# EAGLE design dualstep (EAGLE 5.11)
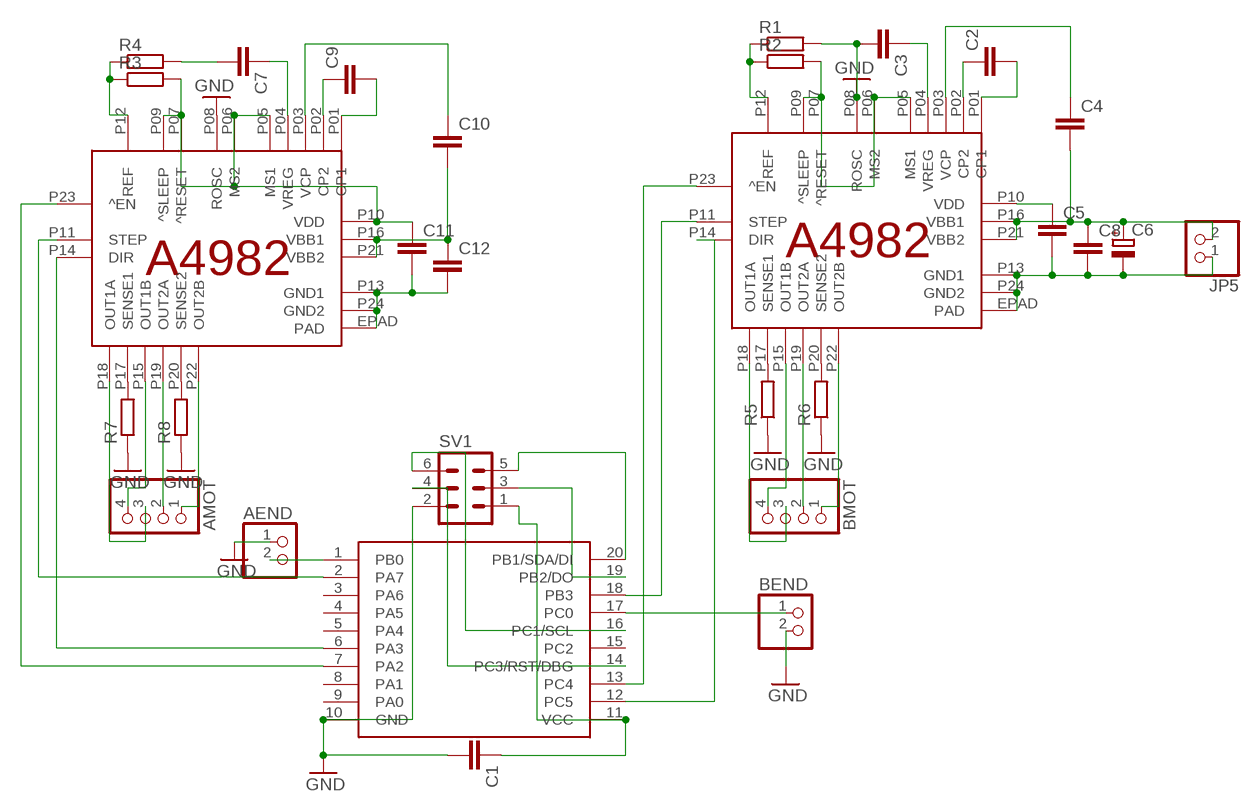
[diagram p0: schematic, sheet 1]

## Parts
AEND  PINHD-1X2  [1X02]
AMOT  PINHD-1X4  [1X04]
BEND  PINHD-1X2  [1X02]
BMOT  PINHD-1X4  [1X04]
C1  C-EUC0603K  [C0603K]
C2  C-EUC0603K  [C0603K]
C3  C-EUC0603K  [C0603K]
C4  C-EUC0603K  [C0603K]
C5  C-EUC0603K  [C0603K]
C6  CPOL-EU153CLV-0605  [153CLV-0605]
C7  C-EUC0603K  [C0603K]
C8  C-EUC0603K  [C0603K]
C9  C-EUC0603K  [C0603K]
C10  C-EUC0603K  [C0603K]
C11  C-EUC0603K  [C0603K]
C12  C-EUC0603K  [C0603K]
JP5  PINHD-1X2  [1X02]
R1  R-EU_R0603  [R0603]
R2  R-EU_R0603  [R0603]
R3  R-EU_R0603  [R0603]
R4  R-EU_R0603  [R0603]
R5  R-EU_R0603  [R0603]
R6  R-EU_R0603  [R0603]
R7  R-EU_R0603  [R0603]
R8  R-EU_R0603  [R0603]
SV1  MA03-2  [MA03-2]
U$1  ATTINY1634  [SOIC20]
U$2  A4982  [ETSSOP24]
U$3  A4982  [ETSSOP24]

## Nets
GND: AEND.1 BEND.2 C1.2 C3.2 C5.2 C6.- C7.2 C8.2 C11.2 C12.2 JP5.1 R1.2 R4.2 R5.1 R6.1 R7.1 R8.1 SV1.2 U$1.10(GND) U$2.EPAD(PAD) U$2.P08(ROSC) U$2.P13(GND1) U$2.P24(GND2) U$3.EPAD(PAD) U$3.P08(ROSC) U$3.P13(GND1) U$3.P24(GND2)
N$1: U$1.12(PC5) U$3.P14(DIR)
N$2: U$1.18(PB3) U$3.P11(STEP)
N$3: R1.1 R2.1 U$3.P12(REF)
N$4: C2.1 U$3.P02(CP2)
N$5: C3.1 U$3.P04(VREG)
N$6: C2.2 U$3.P01(CP1)
N$7: C4.1 U$3.P03(VCP)
N$8: R3.1 R4.1 U$2.P12(REF)
N$9: U$1.13(PC4) U$3.P23(^EN)
N$10: SV1.5 U$1.20(PB1/SDA/DI)
N$11: SV1.3 U$1.19(PB2/DO)
N$12: SV1.6 U$1.16(PC1/SCL)
N$13: SV1.4 U$1.14(PC3/RST/DBG)
N$15: C7.1 U$2.P04(VREG)
N$16: C9.1 U$2.P02(CP2)
N$17: C9.2 U$2.P01(CP1)
N$18: C10.1 U$2.P03(VCP)
N$19: AEND.2 U$1.1(PB0)
N$20: R5.2 U$3.P17(SENSE1)
N$21: R6.2 U$3.P20(SENSE2)
N$22: R7.2 U$2.P17(SENSE1)
N$23: R8.2 U$2.P20(SENSE2)
N$24: AMOT.4 U$2.P15(OUT1B)
N$25: AMOT.1 U$2.P22(OUT2B)
N$26: AMOT.2 U$2.P19(OUT2A)
N$27: AMOT.3 U$2.P18(OUT1A)
N$28: BMOT.4 U$3.P15(OUT1B)
N$29: BMOT.1 U$3.P22(OUT2B)
N$30: BMOT.2 U$3.P19(OUT2A)
N$31: BMOT.3 U$3.P18(OUT1A)
N$32: BEND.1 U$1.17(PC0)
N$33: U$1.2(PA7) U$2.P11(STEP)
N$34: U$1.6(PA3) U$2.P14(DIR)
N$35: U$1.7(PA2) U$2.P23(^EN)
VDD: C1.1 C5.1 C11.1 R2.2 R3.2 SV1.1 U$1.11(VCC) U$2.P05(MS1) U$2.P06(MS2) U$2.P07(^RESET) U$2.P09(^SLEEP) U$2.P10(VDD) U$3.P05(MS1) U$3.P06(MS2) U$3.P07(^RESET) U$3.P09(^SLEEP) U$3.P10(VDD)
VMOT: C4.2 C6.+ C8.1 C10.2 C12.1 JP5.2 U$2.P16(VBB1) U$2.P21(VBB2) U$3.P16(VBB1) U$3.P21(VBB2)
Unconnected: U$1.3(PA6) U$1.4(PA5) U$1.5(PA4) U$1.8(PA1) U$1.9(PA0) U$1.15(PC2)

## Library data of the parts
AEND BEND JP5 = pinhead:PINHD-1X2: PIN HEADER
AMOT BMOT = pinhead:PINHD-1X4: PIN HEADER
C1-C5 C7-C12 = rcl:C-EU: CAPACITOR, European symbol
C6 = rcl:CPOL-EU: POLARIZED CAPACITOR, European symbol
R1-R8 = rcl:R-EU_: RESISTOR, European symbol
SV1 = con-lstb:MA03-2: PIN HEADER; OC_FARNELL: unknown; OC_NEWARK: unknown
U$1 = untitled:ATTINY1634
U$2 U$3 = untitled:A4982

## Board
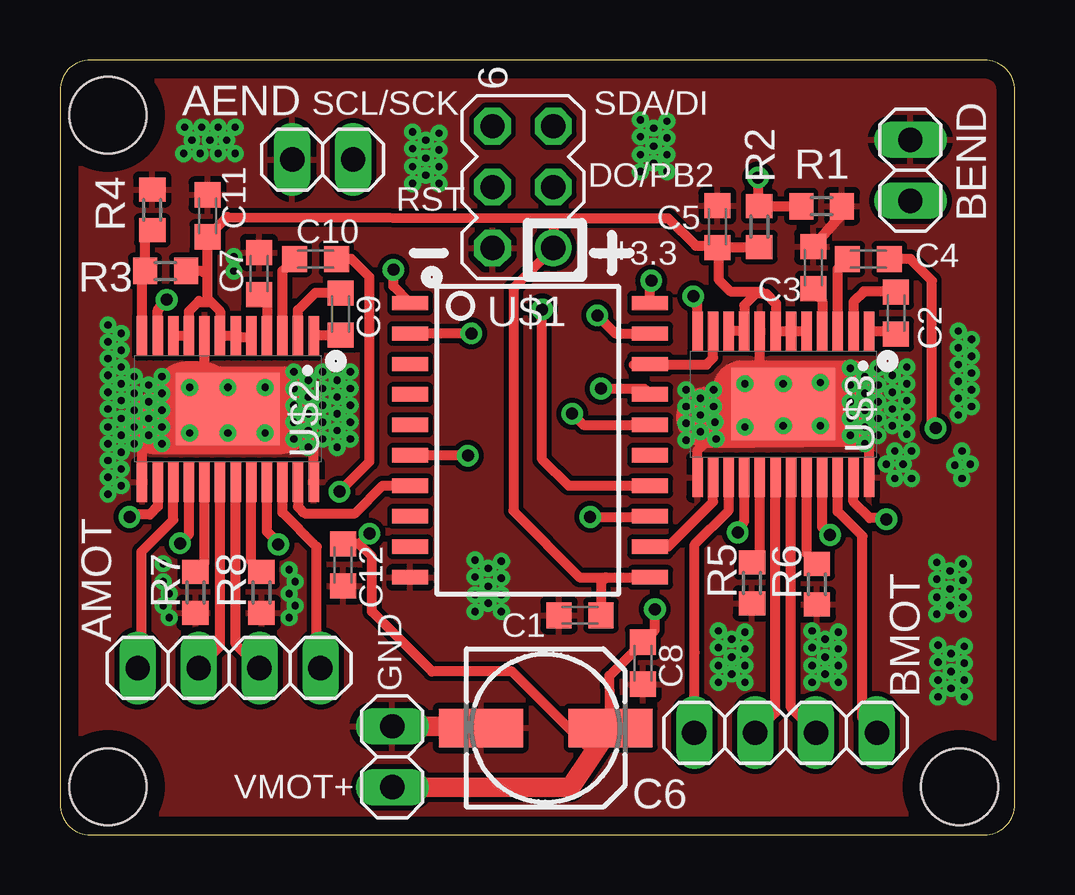
[diagram p1: board, top side]
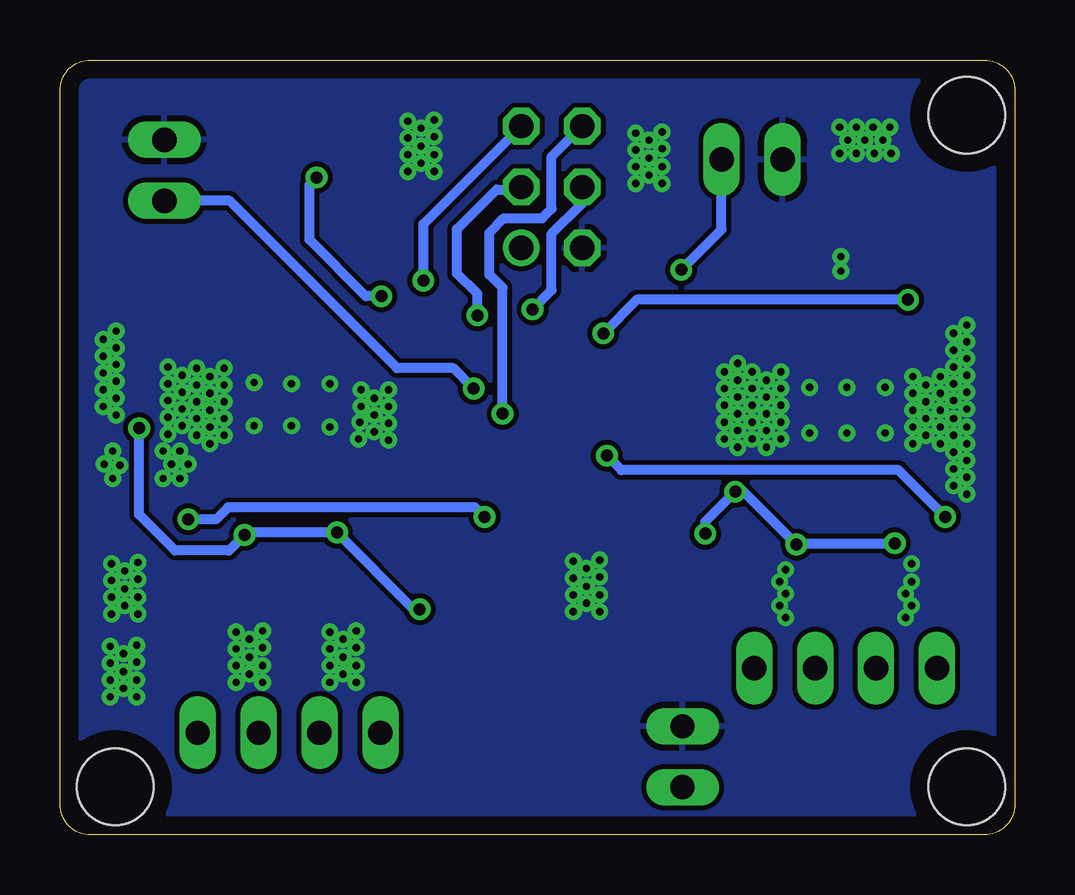
[diagram p2: board, bottom side, seen from below]

Size 39.8 x 32.3 mm. Coordinates in mm from the lower left corner, seen from the top.
Outline: 39.8,31.03 arc90 38.53,32.3 1.27,32.3 arc90 0,31.03 0,1.27 arc90 1.27,0 38.53,0 arc90 39.8,1.27 39.8,31.03
Copper layers (1*16): Top 0.035mm / dielectric 1.5mm / Bottom 0.035mm
Design rules "default *": minimum track width 10mil, minimum drill 10mil, track to track 8mil, track to pad 8mil, pad to pad 8mil, via to via 8mil, smd to smd 0mil, copper to edge 30mil, drill to drill 8mil, minimum pad ring 10mil, minimum via ring 8mil, stop-mask expansion 1mil, vias tented up to drill 20mil, thermal gap 10mil
Holes 3.2 mm at 2,2 2,30 37.5,2

### Footprints (pad centres in the part's own frame; a part is rotated, then mirrored left to right if it is on the bottom)
1X02 = drill 1.016 long: 1 -1.27,0; 2 1.27,0
1X04 = drill 1.016 long: 1 -3.81,0; 2 -1.27,0; 3 1.27,0; 4 3.81,0
C0603K = smd 1.05 x 1.08: 1 -0.875,0; 2 0.875,0
153CLV-0605 = smd 3.5 x 1.6: + 2.7,0; - -2.7,0
R0603 = smd 1 x 1.1: 1 -0.85,0; 2 0.85,0
MA03-2 = drill 1.016 round: 1 -2.54,-1.27 | drill 1.016 octagon: 2 -2.54,1.27; 3 0,-1.27; 4 0,1.27; 5 2.54,-1.27; 6 2.54,1.27
SOIC20 = smd 0.6 x 1.5: 1 -5.715,-5; 2 -4.445,-5; 3 -3.175,-5; 4 -1.905,-5; 5 -0.635,-5; 6 0.635,-5; 7 1.905,-5; 8 3.175,-5; 9 4.445,-5; 10 5.715,-5; 11 5.715,5; 12 4.445,5; 13 3.175,5; 14 1.905,5; 15 0.635,5; 16 -0.635,5; 17 -1.905,5; 18 -3.175,5; 19 -4.445,5; 20 -5.715,5
ETSSOP24 = smd 3 x 4.32: EPAD 0,0 | smd 1.635 x 0.44: P01 -3.05,3.575; P02 -3.05,2.925; P03 -3.05,2.275; P04 -3.05,1.625; P05 -3.05,0.975; P06 -3.05,0.325; P07 -3.05,-0.325; P08 -3.05,-0.975; P09 -3.05,-1.625; P10 -3.05,-2.275; P11 -3.05,-2.925; P12 -3.05,-3.575; P13 3.05,-3.575; P14 3.05,-2.925; P15 3.05,-2.275; P16 3.05,-1.625; P17 3.05,-0.975; P18 3.05,-0.325; P19 3.05,0.325; P20 3.05,0.975; P21 3.05,1.625; P22 3.05,2.275; P23 3.05,2.925; P24 3.05,3.575

### Placement (x,y rotation side)
AEND  10.95,28.15 0 top
AMOT  7.05,6.95 180 top
BEND  35.45,27.7 90 top
BMOT  30.25,4.25 180 top
C1  21.68,9.15 180 top
C2  34.85,21.75 270 top
C3  31.4,23.65 90 top
C4  33.7,24 0 top
C5  27.4,25.35 90 top
C6  20.25,4.45 0 top
C7  8.3,23.4 90 top
C8  24.3,7.15 270 top
C9  11.7,21.7 270 top
C10  10.65,24 0 top
C11  6.15,25.8 90 top
C12  11.8,11.25 270 top
JP5  13.85,3.25 270 top
R1  31.75,26.2 0 top
R2  29.15,25.35 270 top
R3  4.4,23.5 0 top
R4  3.85,26.05 90 top
R5  28.85,10.5 90 top
R6  31.55,10.45 90 top
R7  5.65,10.1 90 top
R8  8.4,10.1 90 top
SV1  19.3,27 90 top
U$1  19.6,16.45 270 top
U$2  7,17.75 270 top
U$3  30.15,17.95 270 top

### Tracks (layer width: path | path; a pad name or v marks a point on that pad's centre or on a via)
GND  (via drill 0.3)
  Top 0.406: U$3.P08 29.18,18.93 29.32,18.77 | 29.32,18.77 U$3.EPAD 30.2,18 32.1,18 33.73,16.38 U$3.P24 | R1.2 32.6,25.88 C3.2 | U$3.P13 26.57,16.02 29.32,18.77 | 6.03,18.73 U$2.P08 | 6.03,18.73 U$2.EPAD 7.1,17.85 9.75,17.85 10.53,17.07 U$2.P24 | U$2.P13 3.42,16.12 6.03,18.73
  Top 0.813: JP5.1 16.58,4.52 C6.-
  Top 2.54: 26.95,17.4 33,17.45 33,18.5 28.45,18.5 28.45,18.45 | 3.85,17.15 9.25,17.15 9.25,18.25 5.95,18.25 5.95,18.45 5.2,18.45 5.2,18.4
  other vias: 5.4,18.65 5.4,16.75 7,18.65 7,16.75 8.55,16.75 8.55,18.65 9.75,19.3 9.75,18.6 9.75,17.9 9.75,17.2 9.75,16.5 10.35,16.85 10.35,17.55 10.35,18.25 10.35,18.95 10.35,16.15 10.95,18.6 10.95,19.3 10.95,17.9 10.95,17.2 10.95,16.5 11.55,16.85 11.55,16.15 11.55,17.55 11.55,18.25 11.55,18.95 11.55,19.65 12.1,19.3 12.1,18.6 12.1,17.9 12.1,17.2 12.1,16.5 3.1,18.4 3.1,19.1 3.1,17.7 3.1,17 3.1,16.3 3.7,16.65 3.7,17.35 3.7,18.05 3.7,18.75 4.25,19.1 4.25,18.4 4.25,17.7 4.25,17 4.25,16.3 2,18.45 2,17.75 2,19.15 2,19.85 2,20.55 2,21.25 2.55,20.9 2.55,20.2 2.55,19.5 2.55,18.8 2.55,18.1 2,14.9 2,14.2 2,15.6 2,16.3 2,17 2.55,17.35 2.55,16.65 2.55,15.95 2.55,15.25 2.55,14.55 26.1,18.55 26.1,17.85 26.1,17.15 26.7,17.5 26.7,18.2 27.25,18.55 27.25,17.85 32.95,18.75 32.95,19.45 32.95,18.05 32.95,17.35 32.95,16.65 33.55,17 33.55,16.3 33.55,17.7 33.55,18.4 33.55,19.1 34.1,19.45 34.1,18.75 34.1,18.05 34.1,17.35 34.1,16.65 34.7,19.15 34.7,18.45 34.7,17.75 34.7,17.05 35.3,17.4 35.3,16.7 35.3,18.1 35.3,18.8 35.3,19.5 37.45,18.2 37.45,17.5 37.45,18.9 37.45,19.6 37.45,20.3 37.45,21 38,20.65 38,19.95 38,19.25 38,18.55 38,17.85 35.5,14.85 34.8,14.85 37.6,14.85 37.3,15.4 37.95,15.45 35.15,15.45 34.45,15.45 34.8,16 35.5,16 37.6,16 27.3,17.2 26.7,16.8 27.35,16.5 26.1,16.45 28.55,18.8 30.15,18.8 31.7,18.85 31.7,17.05 30.15,17.05 28.55,17 7.25,23.5 7.25,24.1 5.2,29.5 5.9,29.5 6.6,29.5 7.3,29.5 5.15,28.4 5.85,28.4 5.5,28.95 7.3,28.4 6.6,28.4 6.25,28.95 6.95,28.95 15.8,29.25 15.8,28.55 15.8,27.85 15.8,27.15 14.7,29.3 14.7,28.6 15.25,28.95 14.7,27.15 14.7,27.85 15.25,28.2 15.25,27.5 25.3,29.75 25.3,29.05 25.3,28.35 25.3,27.65 24.2,29.8 24.2,29.1 24.75,29.45 24.2,27.65 24.2,28.35 24.75,28.7 24.75,28 18.4,11.4 18.4,10.7 18.4,10 18.4,9.3 17.3,11.45 17.3,10.75 17.85,11.1 17.3,9.3 17.3,10 17.85,10.35 17.85,9.65 37.65,11.3 37.65,10.6 37.65,9.9 37.65,9.2 36.55,11.35 36.55,10.65 37.1,11 36.55,9.2 36.55,9.9 37.1,10.25 37.1,9.55 37.7,7.85 37.7,7.15 37.7,6.45 37.7,5.75 36.6,7.9 36.6,7.2 37.15,7.55 36.6,5.75 36.6,6.45 37.15,6.8 37.15,6.1 28.55,8.45 28.55,7.75 28.55,7.05 28.55,6.35 27.45,8.5 27.45,7.8 28,8.15 27.45,6.35 27.45,7.05 28,7.4 28,6.7 32.45,8.45 32.45,7.75 32.45,7.05 32.45,6.35 31.35,8.5 31.35,7.8 31.9,8.15 31.35,6.35 31.35,7.05 31.9,7.4 31.9,6.7 4.3,11.3 4.3,10.55 4.55,10.05 4.3,9.55 4.55,9.05 9.55,11.05 9.8,10.55 9.55,10.05 9.8,9.55 9.55,9.05
  pour Bottom: -0.9,33.65 40.25,33.65 40.25,-2.3 -1.8,-2.3 -1.8,33.75
  pour Top: 0.6,32 39.25,32 39.25,0.15 0.15,0.15 0.15,31.6
N$1
  Top 0.406: U$3.P14 27.23,13.88 25.35,12 U$1.12
N$2
  Top 0.406: U$3.P11 27.23,19.88 26.95,19.6 23.93,19.6 U$1.18
N$3  (via drill 0.5)
  Top 0.406: R1.1 R2.1 29.1,26.25 v29.1,27.4 | U$3.P12 26.57,22.27 v26.4,22.45
  Bottom 0.406: v26.4,22.45 27.05,22.45 29.4,24.8 29.4,27.1 v29.1,27.4
N$4
  Top 0.406: U$3.P02 33.08,22.23 33.5,22.65 34.83,22.65 C2.1
N$5
  Top 0.406: U$3.P04 31.77,22.25 C3.1
N$6
  Top 0.406: U$3.P01 34.73,21 C2.2
N$7
  Top 0.406: U$3.P03 32.42,23.6 C4.1
N$8
  Top 0.406: U$2.P12 3.42,23.27 R3.1 3.55,25.1 R4.1
N$9  (via drill 0.5)
  Top 0.406: U$3.P23 33.08,13.88 33.75,13.2 34.4,13.2 v34.45,13.15 | v22.1,13.25 24.57,13.25 U$1.13
  Bottom 0.406: v34.45,13.15 33.3,13.15 32.8,13.65 22.5,13.65 v22.1,13.25
N$10  (via drill 0.5)
  Top 0.406: U$1.20 24.6,23.05 v24.65,23.1
  Bottom 0.406: v24.65,23.1 24.65,25.46 SV1.5
N$11  (via drill 0.5)
  Top 0.406: U$1.19 23.16,20.89 v22.4,21.65
  Bottom 0.406: v22.4,21.65 22.4,22.55 23.25,23.4 23.25,25.25 21.6,26.9 20.67,26.9 SV1.3
N$12  (via drill 0.5)
  Top 0.406: v21.35,17.55 21.82,17.09 U$1.16
  Bottom 0.406: SV1.6 19.3,28.27 19.3,26.1 19.7,25.7 21.3,25.7 21.9,25.1 21.9,23.35 21.35,22.8 v21.35,17.55
N$13  (via drill 0.5)
  Top 0.406: U$1.14 21.2,14.55 20.1,15.65 v20.1,21.9
  Bottom 0.406: SV1.4 18.03,26.32 19.3,25.05 19.3,22.7 v20.1,21.9
N$15
  Top 0.406: U$2.P04 8.62,22.15 C7.1
N$16
  Top 0.406: U$2.P02 9.93,21.88 10.65,22.6 11.68,22.6 C9.1
N$17
  Top 0.406: U$2.P01 11.68,20.8 C9.2
N$18
  Top 0.406: U$2.P03 9.28,23.5 C10.1
N$19  (via drill 0.5)
  Top 0.406: v13.9,23.55 13.9,22.86 U$1.1
  Bottom 0.406: AEND.2 12.22,25.23 v13.9,23.55
N$20
  Top 0.406: U$3.P17 29.18,11.53 R5.2
N$21
  Top 0.406: U$3.P20 31.12,11.72 R6.2
N$22
  Top 0.406: U$2.P17 6.03,11.32 R7.2
N$23
  Top 0.406: U$2.P20 7.97,11.38 R8.2
N$24
  Top 0.406: U$2.P15 4.72,13.12 3.4,11.8 3.4,7.11 AMOT.4
N$25
  Top 0.406: U$2.P22 9.28,13.43 10.7,12 10.7,7.11 AMOT.1
N$26
  Top 0.406: U$2.P19 7.33,7.95 AMOT.2
N$27
  Top 0.406: U$2.P18 6.67,7.84 AMOT.3
N$28
  Top 0.406: U$3.P15 27.88,13.53 26.45,12.1 26.45,7.59 BMOT.4
N$29
  Top 0.406: U$3.P22 32.42,13.47 33.45,12.45 33.45,4.86 BMOT.1
N$30
  Top 0.406: U$3.P19 30.48,5.29 BMOT.2
N$31
  Top 0.406: U$3.P18 29.82,5.09 BMOT.3
N$32  (via drill 0.5)
  Top 0.406: v22.55,18.6 24.36,18.6 U$1.17
  Bottom 0.406: BEND.1 32.73,26.43 25.75,19.45 23.4,19.45 v22.55,18.6
N$33  (via drill 0.5)
  Top 0.406: U$2.P11 4.08,21.88 v4.45,22.3 | v17.15,20.9 U$1.2
  Bottom 0.406: v4.45,22.3 15.75,22.3 v17.15,20.9
N$34  (via drill 0.5)
  Top 0.406: U$2.P14 4.08,13.68 3.75,13.35 3,13.35 v2.9,13.25 | v17,15.8 14.62,15.8 U$1.6
  Bottom 0.406: v2.9,13.25 4.85,15.2 16.4,15.2 v17,15.8
N$35
  Top 0.406: U$2.P23 9.93,13.68 10.2,13.4 12.3,13.4 13.45,14.55 U$1.7
VDD
  Top 0.406: U$3.P05 U$3.P06 U$3.P07 29.85,21.02 29.85,22.15 29.45,22.55 29.3,22.55 | 29.3,22.55 29,22.55 28.52,22.07 U$3.P09 U$3.P10 | 29.3,22.55 29.2,22.65 27.95,22.65 27.45,23.15 27.45,24.43 C5.1 | R2.2 27.43,24.5 C5.1 | C5.1 27.36,24.51 | U$2.P10 U$2.P09 5.38,21.82 5.8,22.25 5.85,22.2 6.3,22.2 | 6.3,22.2 6.67,21.82 U$2.P07 U$2.P06 7.35,20.8 7.4,20.75 7.92,20.75 U$2.P05 | 6.15,23.3 6.15,22.35 6.3,22.2 | 6.15,23.3 C11.1 6.97,25.75 20.65,25.7 | R3.2 5.95,23.5 6.15,23.3 | 20.65,25.7 20.57,25.62 SV1.1 18.9,22.79 18.9,13.5 21.66,10.73 22.75,10.73 | 20.65,25.7 25.35,25.7 26.5,24.55 27.32,24.55 C5.1 | 22.75,10.73 U$1.11 | C1.1 22.55,10.54 22.75,10.73
VMOT  (via drill 0.5)
  Top 0.406: U$3.P16 28.52,13.07 v28.25,12.6 | 24.8,9.35 v24.8,9.4 24.8,8.53 C8.1 22.9,6.62 C6.+ 22.75,3.75 21.9,3.75 18.85,6.8 15.5,6.8 13,9.3 13,11.6 12.47,12.12 | U$3.P21 31.77,12.82 v32.1,12.5 | C4.2 35.45,24 36.35,23.1 36.35,17.1 v36.5,16.95 | C10.2 12.15,24 12.9,23.25 12.9,15.55 v11.65,14.3 | U$2.P16 5.38,12.53 v5,12.15 | v9.1,12.1 9.1,12.15 8.62,12.62 U$2.P21 | 12.47,12.12 C12.1 | 12.47,12.12 v12.9,12.55
  Top 0.813: JP5.2 21.28,1.98 C6.+
  Bottom 0.406: v24.8,9.4 25.05,9.4 v28.25,12.6 32,12.6 v32.1,12.5 32.75,11.85 35,11.85 36.5,13.35 v36.5,16.95 | v5,12.15 9.05,12.15 v9.1,12.1 11.35,14.35 v11.65,14.3 12.9,13.05 v12.9,12.55

### Text on the board
tPlace: SCL/SCK | SDA/DI | DO/PB2 | RST | 3.3 | GND | VMOT+